# Altium schematic sheet BUTTON.SchDoc
size A; SheetNumber: 6; SheetTotal: 8
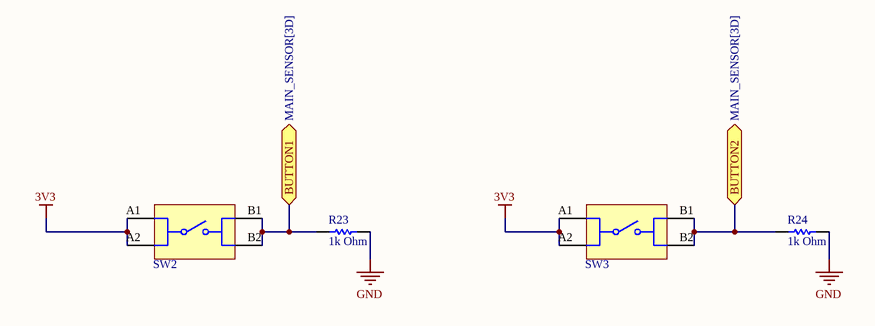
[diagram p0: BUTTON.SchDoc]

## Parts
R23  1k Ohm  [resistor_0603]
R24  1k Ohm  [resistor_0603]
SW2  430152043826  [WS-TASV_L6W6H4.3_4301x20438x6]  (value not drawn)
SW3  430152043826  [WS-TASV_L6W6H4.3_4301x20438x6]  (value not drawn)

## Ports
BUTTON1 (bidir, see MAIN_SENSOR[3D]), BUTTON2 (bidir, see MAIN_SENSOR[3D])

## Nets
3V3: SW2.A1 SW2.A2 SW3.A1 SW3.A2
GND: R23.2 R24.2
BUTTON1: R23.1 SW2.B1 SW2.B2 ; port BUTTON1
BUTTON2: R24.1 SW3.B1 SW3.B2 ; port BUTTON2

## Library data of the parts
R23 R24 = 0006031021: RES, size 0603, 1 KOhm, 1/4 W; Manufacture  Name: OEM; Resistance: 1 KOhm; Rated Power: 1/4 W; Resistance Tolerance: +/-1%; Size: 0603; Mounting Technology: SMT; Supplier 1 Name: Mouser; Supplier 1 SN: 71-RCS06031K00FKEA; Supplier 2 Name: Digi-Key; Supplier 2 SN: YAG5829TR-ND YAG5829CT-ND YAG5829DKR-ND; Supplier 1 URL: https://www.mouser.vn/ProductDetail/Vishay-Dale/RCS06031K00FKEA?qs=sGAEpiMZZMvdGkrng054t9clqp6gtJJdzI9PGMrTQi4RTIuHToNahw%3D%3D; Supplier 3 Name: thegioiic; Supplier 3 SN: N/A; Supplier 3 URL: N/A; Manufacture  SN: OEM; Value: 1 KOhm, 1/4 W; ComponentLink1Description: Datasheet link; ComponentLink1URL: https://www.yageo.com/upload/media/product/productsearch/datasheet/rchip/PYu-SR_20105_RoHS_L_10.pdf; ComponentLink2Description: Supplier 1 URL; ComponentLink2URL: N/A; ComponentLink3Description: Supplier 2 URL; ComponentLink3URL: https://www.digikey.com/en/products/detail/yageo/SR0603FR-7T1KL/9373103; ComponentLink4Description: Supplier 3 URL; ComponentLink4URL: N/A; Supplier 2 URL: https://www.digikey.com/en/products/detail/yageo/SR0603FR-7T1KL/9373103
SW2 SW3 = 430152043826: WS-TASV SMT Tact Switch, L6 x W6 x H4.3mm, 260g, SPST-NO, 12V, 50mA; Manufacturer: Wurth Elektronik; Washable: No; Rated Voltage: 12VDC; Manufacturer Part Number: 430152043826; Category: Tact Switches; Match Code: WS-TASV; ComponentLink2Description: Datasheet Link; ComponentLink2URL: https://www.we-online.com/redexpert/spec/430152043826?ad; Mount: Surface Mount; Operating Temperature Max: 85°C; Operating Temperature Min: -40°C; Packaging: Tape and Reel; Length: 6mm; Width: 6mm; Height: 4.3mm; Circuit: SPST-NO; Contact Material: Stainless Steel; Operation Force: 260g; Rated Current: 50mA; Terminal Material: Copper Alloy; Terminal Plating: Silver; Supplier 1 Name: Mouser; Supplier 1 SN: 710-430152043826; Supplier 1 URL: https://www.mouser.vn/ProductDetail/Wurth-Elektronik/430152043826?qs=wr8lucFkNMUjBcFj1giTsA%3D%3D; Supplier 2 Name: Digi-Key; Supplier 2 SN: 732-6991-2-ND; Supplier 2 URL: https://www.digikey.com/en/products/detail/w%C3%BCrth-elektronik/430152043826/5208994; Supplier 3 Name: Thegioiic; Supplier 3 SN: N/A; Supplier 3 URL: https://www.thegioiic.com/nut-nhan-6x6mm-cao-4-3mm-4-chan-smd